# Altium schematic sheet W5500_Module.SchDoc: RP2040 CNC
size C; Author: AM; CompanyName: Expatria Technologies; DrawnBy: A.Marles; Engineer: AM; Organization: Expatria Technolgoies; Address1: Schematic; DocumentNumber: 2; SheetNumber: 5; SheetTotal: 9
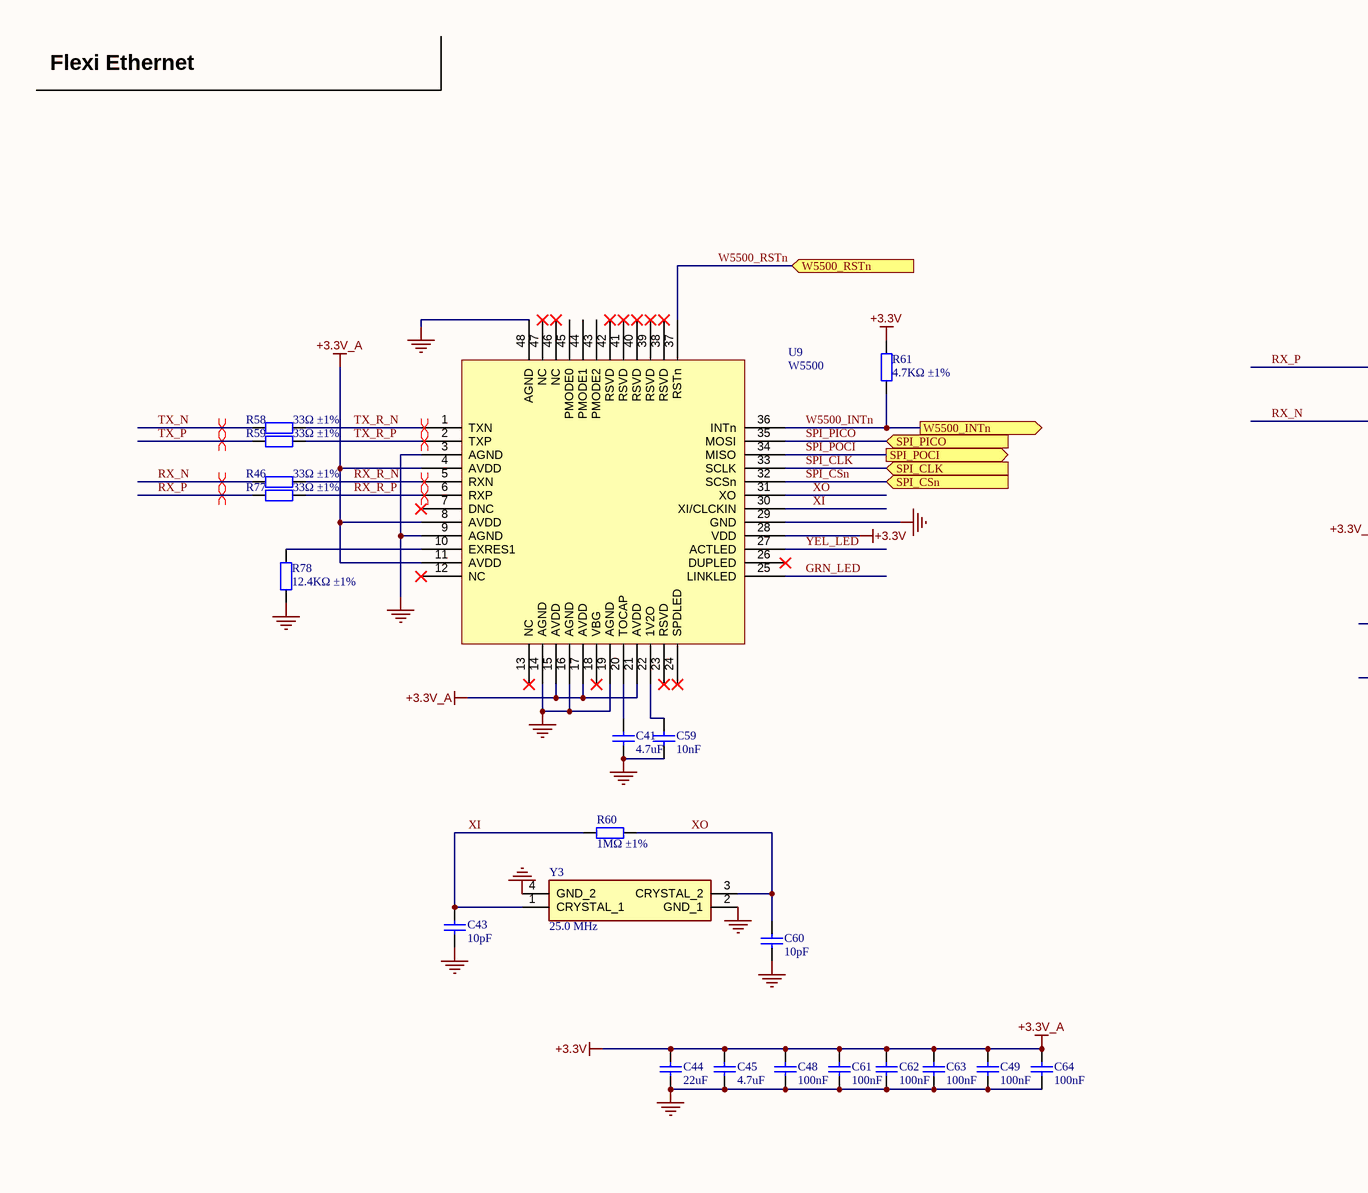
[diagram p0: W5500_Module.SchDoc, left]
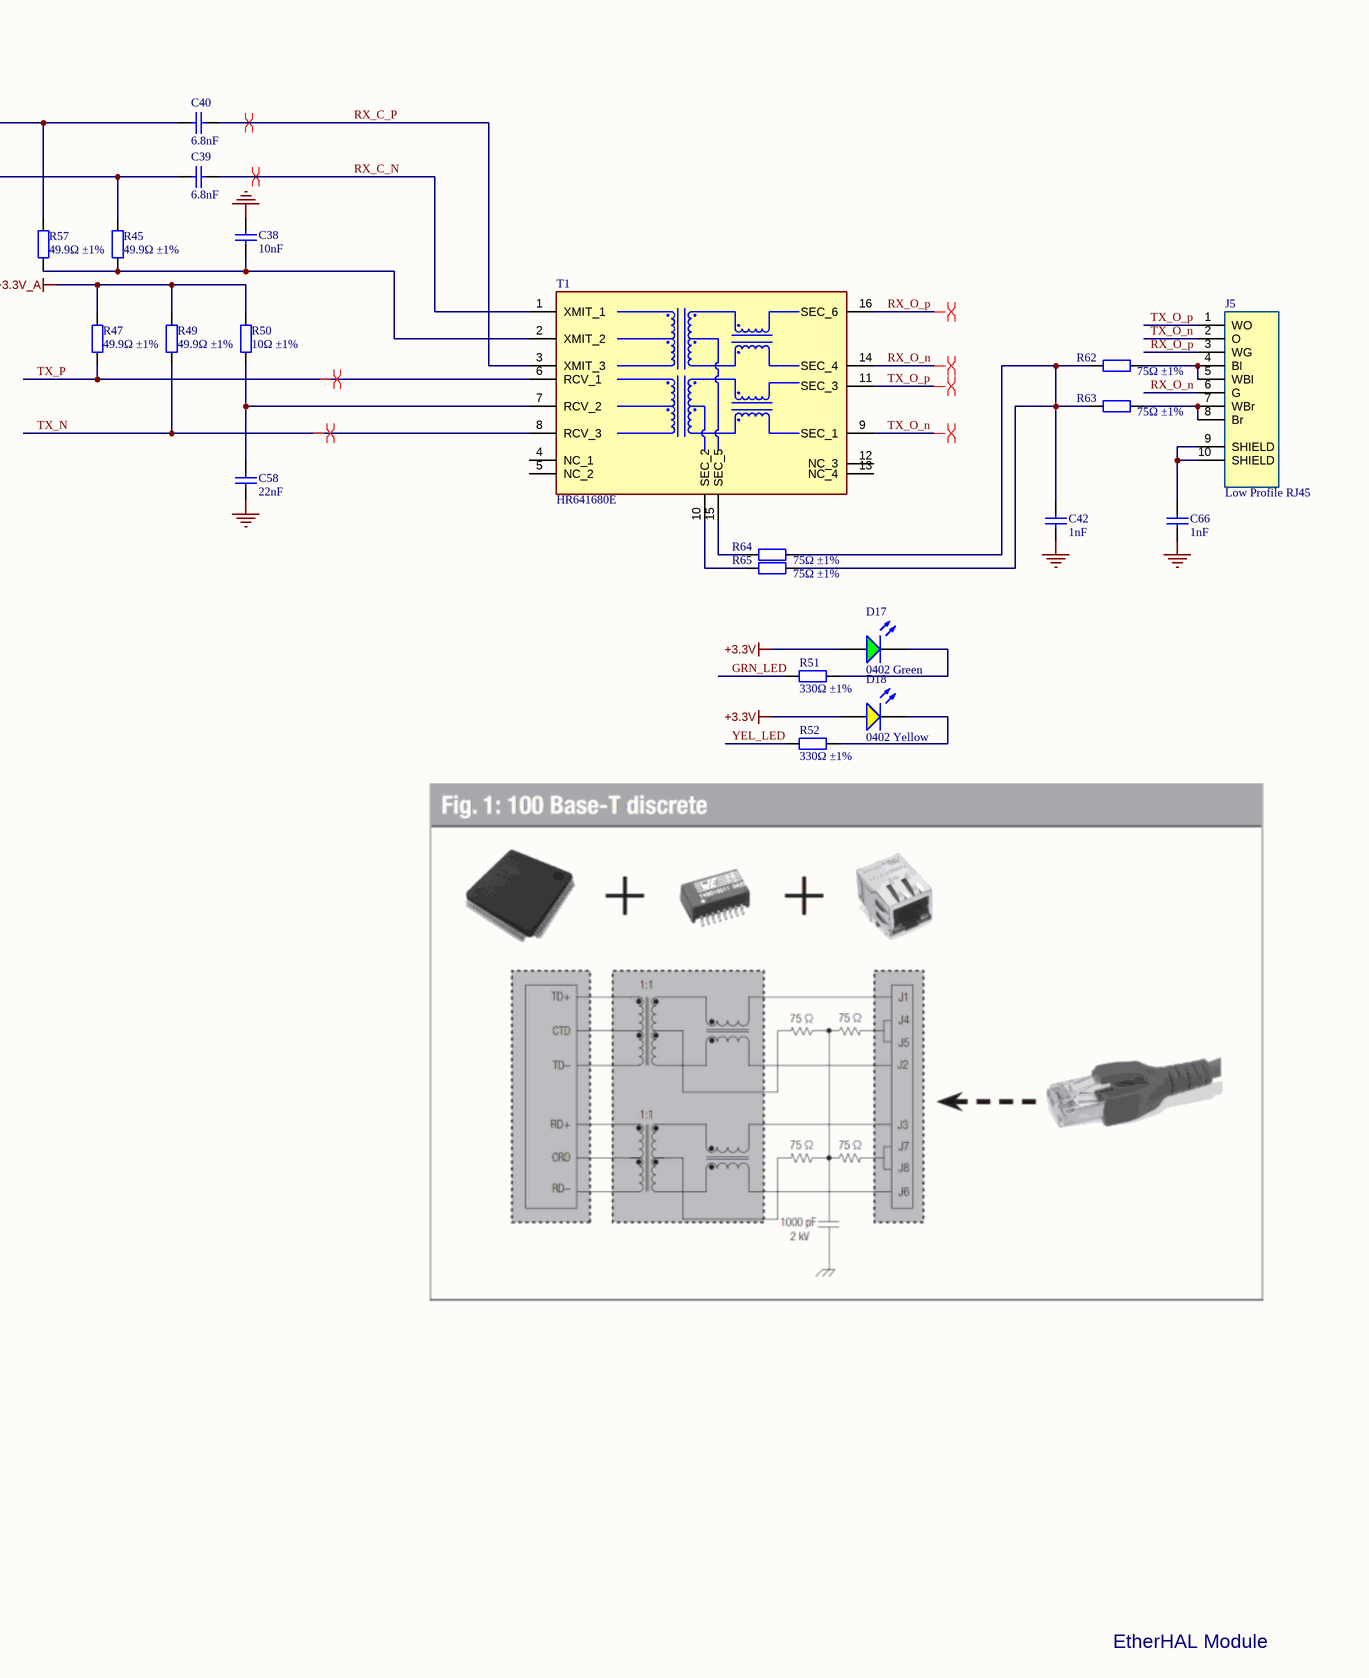
[diagram p1: W5500_Module.SchDoc, right]

## Parts
C38  10nF  [0402_C]
C39  6.8nF  [0402_C]
C40  6.8nF  [0402_C]
C41  4.7uF  [0402_C]
C42  1nF  [1206_C]
C43  10pF  [0402_C]
C44  22uF  [0805_C]
C45  4.7uF  [0603_C]
C48  100nF  [0402_C]
C49  100nF  [0402_C]
C58  22nF  [0402_C]
C59  10nF  [0402_C]
C60  10pF  [0402_C]
C61  100nF  [0402_C]
C62  100nF  [0402_C]
C63  100nF  [0402_C]
C64  100nF  [0402_C]
C66  1nF  [1206_C]
D17  0402 Green  [LED 0402_1005 RED]
D18  0402 Yellow  [LED 0402_1005 RED]
J5  Low Profile RJ45  [RJ45-SMD_MJ88-B011-HLSV6-P]
R45  49.9Ω ±1%  [0402_R]
R46  33Ω ±1%  [0402_R]
R47  49.9Ω ±1%  [0402_R]
R49  49.9Ω ±1%  [0402_R]
R50  10Ω ±1%  [0402_R]
R51  330Ω ±1%  [0402_R]
R52  330Ω ±1%  [0402_R]
R57  49.9Ω ±1%  [0402_R]
R58  33Ω ±1%  [0402_R]
R59  33Ω ±1%  [0402_R]
R60  1MΩ ±1%  [0402_R]
R61  4.7KΩ ±1%  [0402_R]
R62  75Ω ±1%  [0402_R]
R63  75Ω ±1%  [0402_R]
R64  75Ω ±1%  [0402_R]
R65  75Ω ±1%  [0402_R]
R77  33Ω ±1%  [0402_R]
R78  12.4KΩ ±1%  [0603_R]
T1  HR641680E  [HR641680E]
U9  W5500  [LQFP-48_7x7x05P]
Y3  25.0 MHz  [YSX321SL]

## Ports
SPI_CLK (in), SPI_CSn (in), SPI_PICO (in), SPI_POCI (out), W5500_INTn (out), W5500_RSTn (in)

## Nets
+3.3V: C44.2 C45.2 C48.2 C49.2 C61.2 C62.2 C63.2 C64.2 D17.A D18.A R47.1 R49.1 R50.1 R61.1 U9.4(AVDD) U9.8(AVDD) U9.11(AVDD) U9.15(AVDD) U9.17(AVDD) U9.21(AVDD) U9.28(VDD)  [also labelled +3.3V_A]
GND: C38.1 C41.1 C42.1 C43.1 C44.1 C45.1 C48.1 C49.1 C58.1 C59.1 C60.1 C61.1 C62.1 C63.1 C64.1 C66.1 R78.1 U9.3(AGND) U9.9(AGND) U9.14(AGND) U9.16(AGND) U9.19(AGND) U9.29(GND) U9.48(AGND) Y3.2(GND_1) Y3.4(GND_2)
GRN_LED: R51.1 U9.25(LINKLED)
RX_C_N: C39.1 T1.1(XMIT_1)
RX_C_P: C40.1 T1.3(XMIT_3)
RX_N: C39.2 R45.2 R46.1
RX_O_n: J5.6(G) T1.14(SEC_4)
RX_O_p: J5.3(WG) T1.16(SEC_6)
RX_P: C40.2 R57.2 R77.1
RX_R_N: R46.2 U9.5(RXN)
RX_R_P: R77.2 U9.6(RXP)
SPI_CLK: U9.33(SCLK) ; port SPI_CLK
SPI_CSn: U9.32(SCSn) ; port SPI_CSn
SPI_PICO: U9.35(MOSI) ; port SPI_PICO
SPI_POCI: U9.34(MISO) ; port SPI_POCI
TX_N: R49.2 R58.1 T1.8(RCV_3)
TX_O_n: J5.2(O) T1.9(SEC_1)
TX_O_p: J5.1(WO) T1.11(SEC_3)
TX_P: R47.2 R59.1 T1.6(RCV_1)
TX_R_N: R58.2 U9.1(TXN)
TX_R_P: R59.2 U9.2(TXP)
W5500_INTn: R61.2 U9.36(INTn) ; port W5500_INTn
W5500_RSTn: U9.37(RSTn) ; port W5500_RSTn
XI: C43.2 R60.1 U9.30(XI/CLCKIN) Y3.1(CRYSTAL_1)
XO: C60.2 R60.2 U9.31(XO) Y3.3(CRYSTAL_2)
YEL_LED: R52.1 U9.27(ACTLED)
NetC38_2: C38.2 R45.1 R57.1 T1.2(XMIT_2)
NetC41_2: C41.2 U9.20(TOCAP)
NetC42_2: C42.2 R62.2 R63.2 R64.1 R65.1
NetC58_2: C58.2 R50.2 T1.7(RCV_2)
NetC59_2: C59.2 U9.22(1V2O)
NetC66_2: C66.2 J5.9(SHIELD) J5.10(SHIELD)
NetD17_K: D17.K R51.2
NetD18_K: D18.K R52.2
NetJ5_4: J5.4(Bl) J5.5(WBl) R62.1
NetJ5_7: J5.7(WBr) J5.8(Br) R63.1
NetR64_2: R64.2 T1.15(SEC_5)
NetR65_2: R65.2 T1.10(SEC_2)
NetR78_2: R78.2 U9.10(EXRES1)

Not connected (* = marked no-connect by the designer): T1 4(NC_1) 5(NC_2) 12(NC_3) 13(NC_4); U9 7(DNC)* 12(NC)* 13(NC)* 18(VBG)* 23(RSVD)* 24(SPDLED)* 26(DUPLED)* 38(RSVD)* 39(RSVD)* 40(RSVD)* 41(RSVD)* 42(RSVD)* 43(PMODE2) 44(PMODE1) 45(PMODE0) 46(NC)* 47(NC)*

## Layout directives
differential pair: RX_C_N, RX_C_P, RX_N, RX_O_n, RX_O_p, RX_P, RX_R_N, RX_R_P, TX_N, TX_O_n, TX_O_p, TX_P, TX_R_N, TX_R_P

## Notes on the sheet
- Flexi Ethernet
- EtherHAL Module
- Expatria Technologies
- SHEET
- PROJECT
- REV
- 1136 Glade Court
- Port Coquitlam, BC V3B 1R5
- EMAIL: INFO@EXPATRIA.CA
- SIZE
- ENGR
- C
- MODIFIED
- DOCUMENT
- /
- Copyright Expatria Technologies 2021.  This document describes Open Hardware and is licensed under the CERN-OHL-P  v2.  No warranty is implied or expressed.

## Library data of the parts
C38 C59 = 0402 10nF (103) 10% 50V: Chip capacitors; Manufacturer: Samsung Electro-Mechanics; PartNumber: CL05B103KB5NNNC; Tolerance: 10%; Voltage: 50V; ComponentLink1Description: Supplier link; ComponentLink1URL: http://www.szlcsc.com/product/details_15869.html; Package: 0402; Supplier: LC; SuppliersPartNumber: C15195; Capacitance: 10nF
C39 C40 = 0402 6.8nF (682) 10% 50V: Chip capacitors; Manufacturer: Guangdong Fenghua Advanced Tech; PartNumber: 0402B682K500NT; Tolerance: 10%; Voltage: 50V; ComponentLink1Description: Supplier link; ComponentLink1URL: http://www.szlcsc.com/product/details_1894.html; Package: 0402; Supplier: LC; SuppliersPartNumber: C1542; Capacitance: 6.8nF
C41 = 0402 4.7uF (475) 20% 10V: Chip capacitor; Manufacturer: Samsung Electro-Mechanics; PartNumber: CL05A475MP5NRNC; Tolerance: 20%; Voltage: 10V; ComponentLink1Description: Supplier link; ComponentLink1URL: http://www.szlcsc.com/product/details_24469.html; Package: 0402; Supplier: LC; SuppliersPartNumber: C23733; Capacitance: 4.7uF
C42 C66 = 1206 1nF (102) 10% 500V: Chip capacitors; Manufacturer: Samsung Electro-Mechanics; PartNumber: CL31B102KGFNNNE; Tolerance: 10%; Voltage: 500V; ComponentLink1Description: Supplier link; ComponentLink1URL: http://www.szlcsc.com/product/details_36187.html; Package: 1206; Supplier: LC; SuppliersPartNumber: C35216; Capacitance: 1nF
C43 C60 = 0402 10pF (100) 5% 50V: Chip capacitors; Manufacturer: Samsung Electro-Mechanics; PartNumber: CL05C100JB5NNNC; Tolerance: 5%; Voltage: 50V; ComponentLink1Description: Supplier link; ComponentLink1URL: http://www.szlcsc.com/product/details_33914.html; Package: 0402; Supplier: LC; SuppliersPartNumber: C32949; Capacitance: 10pF
C44 = 0805 22uF (226) 20% 25V: Chip capacitors; Manufacturer: Samsung Electro-Mechanics; PartNumber: CL21A226MAQNNNE; Tolerance: 20%; Voltage: 25V; ComponentLink1Description: Supplier link; ComponentLink1URL: http://www.szlcsc.com/product/details_46786.html; Package: 0805; Supplier: LC; SuppliersPartNumber: C2922481; Capacitance: 22uF
C45 = 0603 4.7uF (475) 10% 16V: Chip capacitors; Manufacturer: Samsung Electro-Mechanics; PartNumber: CL10A475KO8NNNC; Tolerance: 10%; Voltage: 16V; ComponentLink1Description: Supplier link; ComponentLink1URL: http://www.szlcsc.com/product/details_20375.html; Package: 0603; Supplier: LC; SuppliersPartNumber: C19666; Capacitance: 4.7uF
C48 C49 C61-C64 = 0402 100nF (104) 10% 16V: Chip capacitors; Manufacturer: Samsung Electro-Mechanics; PartNumber: CL05B104KO5NNNC; Tolerance: 10%; Voltage: 16V; ComponentLink1Description: Supplier link; ComponentLink1URL: http://www.szlcsc.com/product/details_1877.html; Package: 0402; Supplier: LC; SuppliersPartNumber: C1525; Capacitance: 100nF
C58 = 0402 22nF (223) 10% 50V: Chip capacitors; Manufacturer: Guangdong Fenghua Advanced Tech; PartNumber: 0402B223K500NT; Tolerance: 10%; Voltage: 50V; ComponentLink1Description: Supplier link; ComponentLink1URL: http://www.szlcsc.com/product/details_1884.html; Package: 0402; Supplier: LC; SuppliersPartNumber: C1532; Capacitance: 22nF
D17 = 0402 LED Green: LED; Package: 0402; Supplier: LC; SuppliersPartNumber: C130723; Color: Green
D18 = 0402 LED Yellow: LED; ComponentLink1Description: 供应商链接; ComponentLink1URL: http://www.szlcsc.com/product/details_73147.html; Package: 0402; Supplier: LC; SuppliersPartNumber: C130721; Color: Yellow
J5 = MJ88-B011-HLSV6-P: Micro USB; MF: Heling; SuppliersPartNumber: C501463; Part+Number: MJ88-B011-HLSV6-P
R45 R47 R49 R57 = 0402 49.9R (49R9) 1%: Chip resistor; Manufacturer: Uniroyal Elec; PartNumber: 0402WGF499JTCE; Power: 1/16W; ComponentLink1Description: Supplier link; ComponentLink1URL: http://www.szlcsc.com/product/details_25863.html; Package: 0402; Supplier: LC; SuppliersPartNumber: C25120; Resistance: 49.9Ω; Tolerance: 1%
R46 R58 R59 R77 = 0402 33R (33R0) 1%: Chip resistor; Manufacturer: Uniroyal Elec; PartNumber: 0402WGF330JTCE; Power: 1/16W; ComponentLink1Description: Supplier link; ComponentLink1URL: http://www.szlcsc.com/product/details_25848.html; Package: 0402; Supplier: LC; SuppliersPartNumber: C25105; Resistance: 33Ω; Tolerance: 1%
R50 = 0402 10R (10R0) 1%: Chip resistor; Manufacturer: Uniroyal Elec; PartNumber: 0402WGF100JTCE; Power: 1/16W; ComponentLink1Description: Supplier link; ComponentLink1URL: http://www.szlcsc.com/product/details_25820.html; Package: 0402; Supplier: LC; SuppliersPartNumber: C25077; Resistance: 10Ω; Tolerance: 1%
R51 R52 = 0402 330R (3300) 1%: Chip resistor; Manufacturer: Uniroyal Elec; PartNumber: 0402WGF3300TCE; Power: 1/16W; ComponentLink1Description: Supplier link; ComponentLink1URL: http://www.szlcsc.com/product/details_25847.html; Package: 0402; Supplier: LC; SuppliersPartNumber: C25104; Resistance: 330Ω; Tolerance: 1%
R60 = 0402 1M (1004) 1%: Chip resistor; Manufacturer: Uniroyal Elec; PartNumber: 0402WGF1004TCE; Power: 1/16W; ComponentLink1Description: Supplier link; ComponentLink1URL: http://www.szlcsc.com/product/details_26826.html; Package: 0402; Supplier: LC; SuppliersPartNumber: C26083; Resistance: 1MΩ; Tolerance: 1%
R61 = 0402 4.7K (4701) 1%: Chip resistor; Manufacturer: Uniroyal Elec; PartNumber: 0402WGF4701TCE; Power: 1/16W; ComponentLink1Description: Supplier link; ComponentLink1URL: http://www.szlcsc.com/product/details_26643.html; Package: 0402; Supplier: LC; SuppliersPartNumber: C25900; Resistance: 4.7KΩ; Tolerance: 1%
R62-R65 = 0402 75R (75R0) 1%: Chip resistor; Manufacturer: Uniroyal Elec; PartNumber: 0402WGF750JTCE; Power: 1/16W; ComponentLink1Description: Supplier link; ComponentLink1URL: http://www.szlcsc.com/product/details_25876.html; Package: 0402; Supplier: LC; SuppliersPartNumber: C25133; Resistance: 75Ω; Tolerance: 1%
R78 = 0603 10K (1002) 1%: Chip resistor; Manufacturer: Uniroyal Elec; PartNumber: 0603WAF1242T5E; Power: 1/10W; Resistance: 12.4K; ComponentLink1Description: Supplier link; ComponentLink1URL: http://www.szlcsc.com/product/details_26547.html; Package: 0603; Supplier: LC; SuppliersPartNumber: C22865; Tolerance: 1%
T1 = HR641680E: Transformer; Manufacturer_Name: Hanrun Electronics; Datasheet Link: https://datasheet.lcsc.com/szlcsc/Zhongshan-HanRun-Elec-HR641680E_C189555.pdf; Height: 5.715mm; Manufacturer_Part_Number: HR641680E
U9 = W5500_[C32843]: Ethernet Controllers 2.97V ~ 3.63V 10/100 Base-T/TX PHY SPI LQFP-48_7x7x05P Ethernet ICs ROHS; ComponentLink1Description: 供应商链接; ComponentLink1URL: http://www.szlcsc.com/product/details_33808.html; Package: LQFP-48_7x7x05P; Supplier: LC; SuppliersPartNumber: C32843
Y3 = YSX321SL: Crystal or Oscillator; Manufacturer_Name: Yangxing Tech; Manufacturer_Part_Number: X322525MSB4SI; Height: 0.8mm; SuppliersPartNumber: C13740